# Altium schematic sheet LoraModule.SchDoc
size 420 x 297 mm; Address1: Address1; Address2: Address2; Address3: Address3; Address4: Address4; DocumentNumber: АБВГ.123456.001 Э3; SheetNumber: 1; Scale: 1:1; DocumentType: Схема электрическая принципиальная; FirstReferrence: АБВГ.123456.001
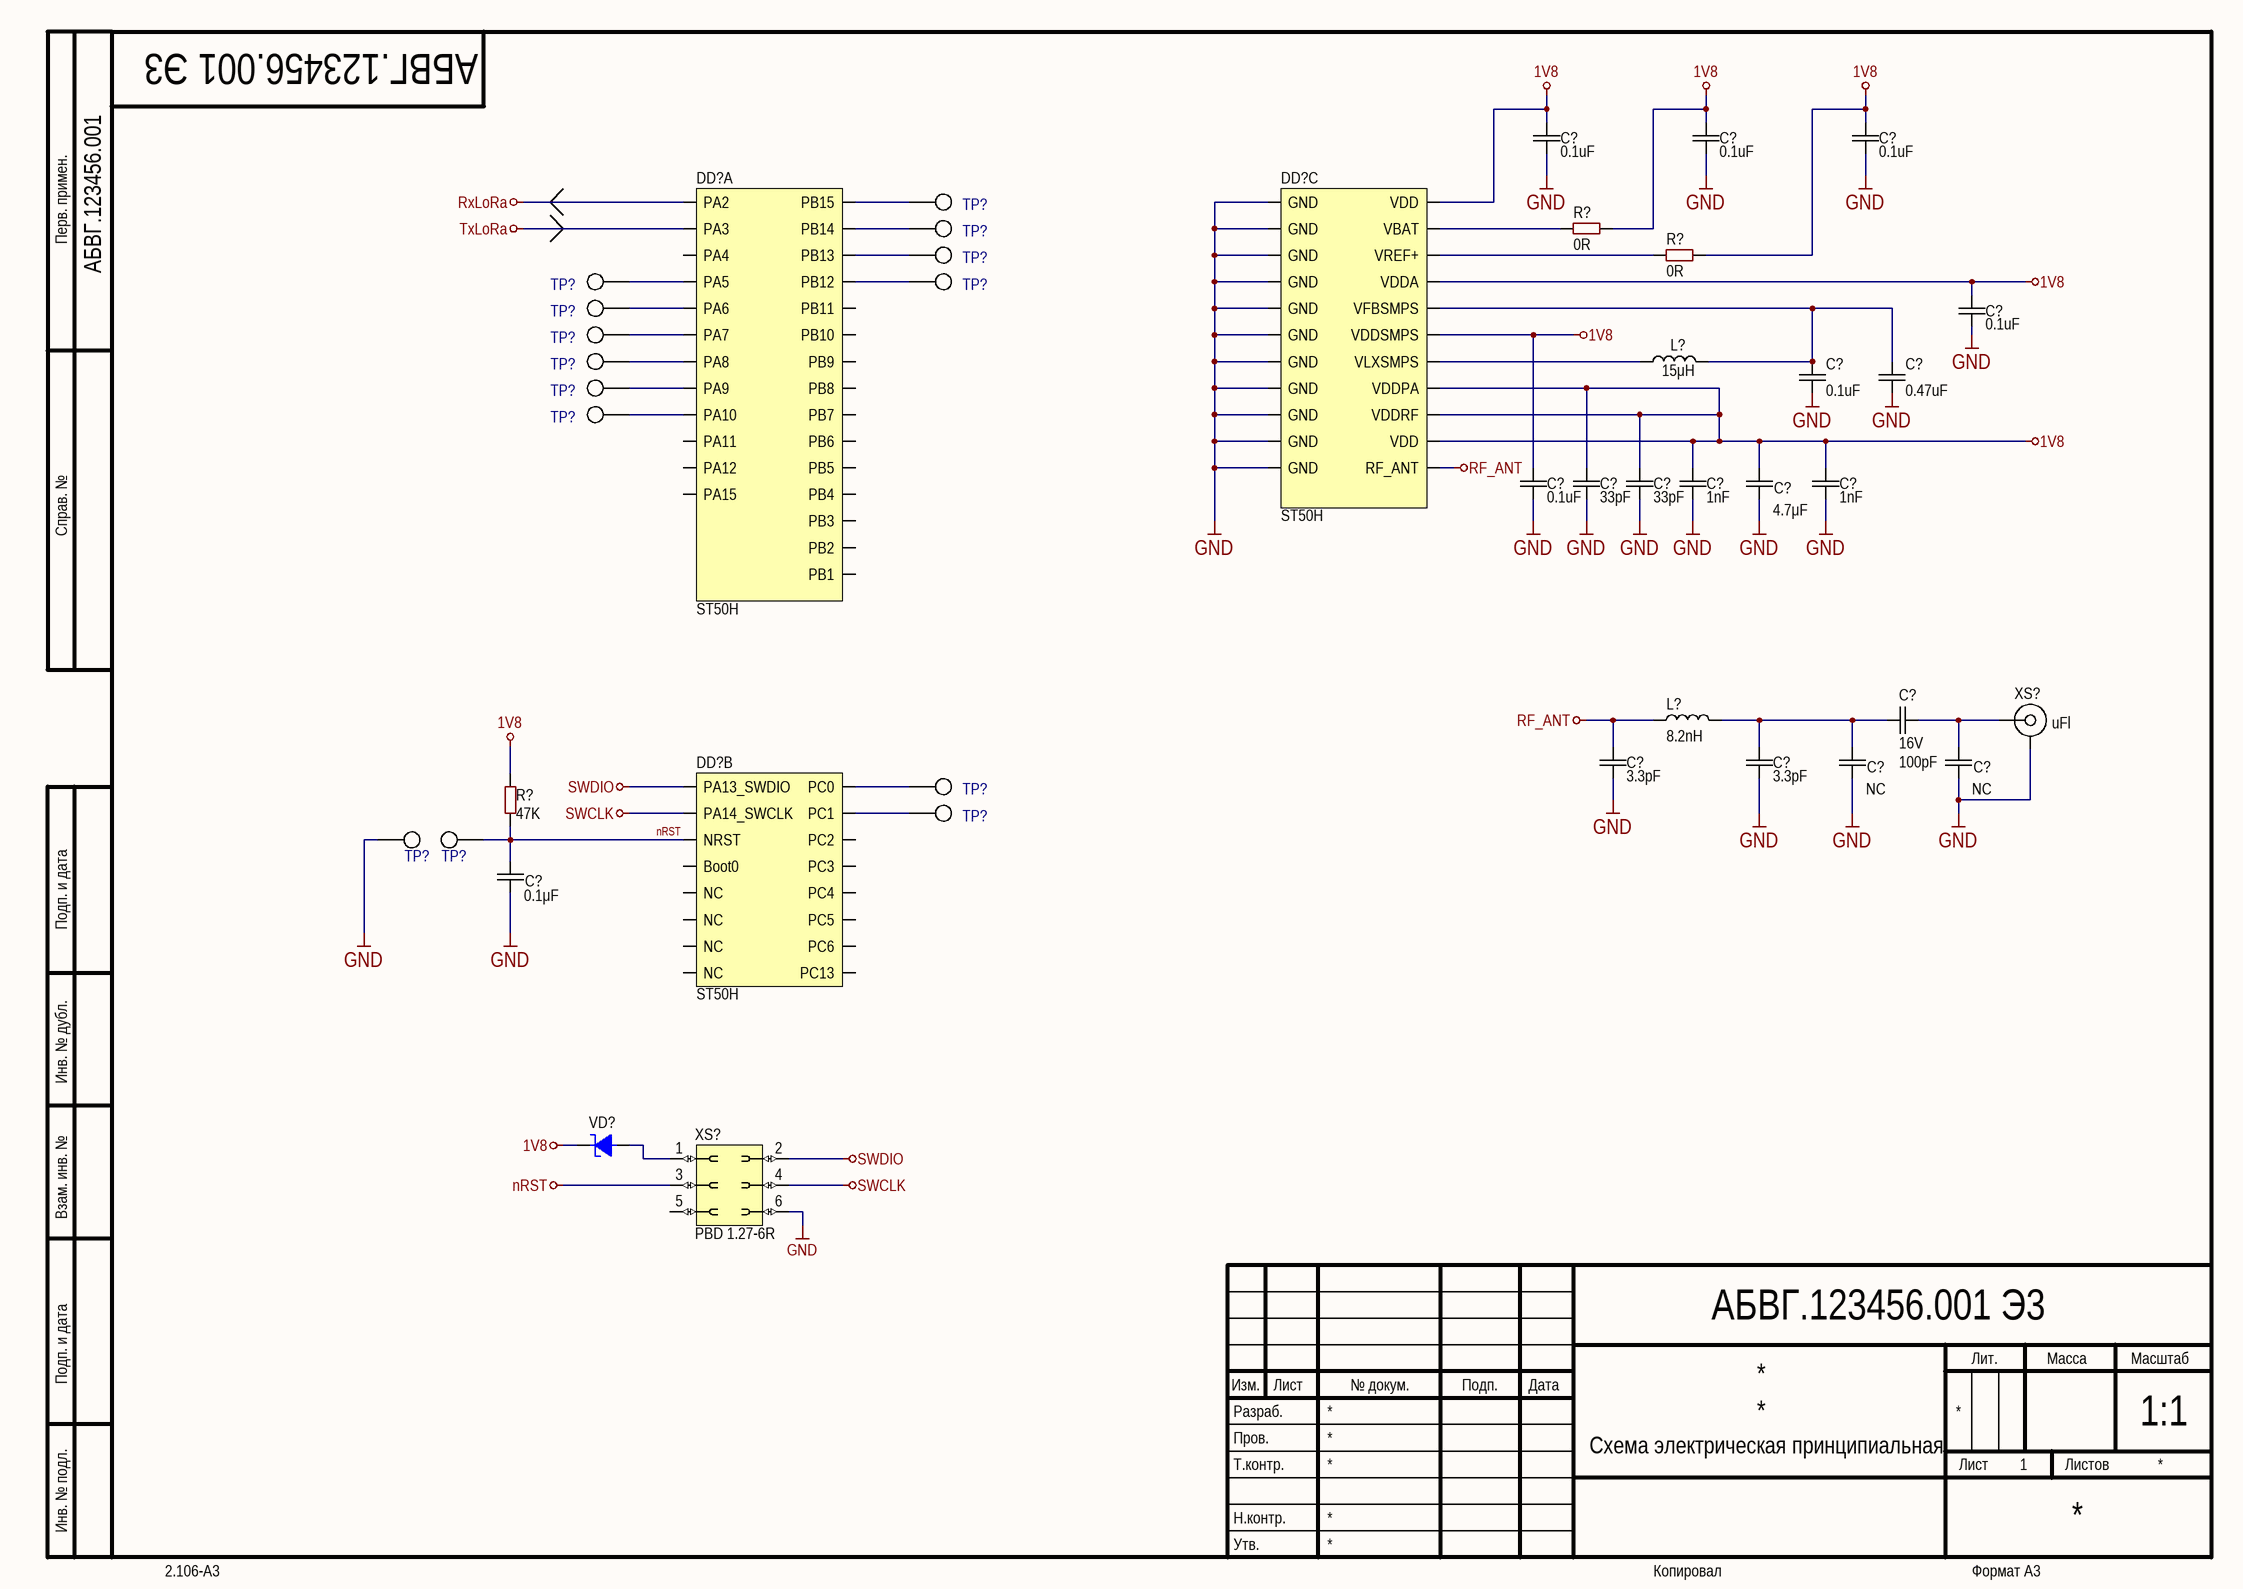
[diagram p0: LoraModule.SchDoc]

## Parts
(Parts that share a designator on the sheet are numbered #1, #2 ... from top to bottom, then left to right.)
C?#1  value 0.1uF  [CAP: 0402]
C?#2  value 0.1uF  [CAP: 0402]
C?#3  value 0.1uF  [CAP: 0402]
C?#4  value 0.1uF  [CAP: 0402]
C?#5  value 0.1uF  [CAP: 0402]
C?#6  value 0.47uF  [CAP: 0402]
C?#7  value 0.1uF  [CAP: 0402]
C?#8  value 33pF  [CAP: 0402]
C?#9  value 33pF  [CAP: 0402]
C?#10  value 1nF  [CAP: 0402]
C?#11  value 4.7μF  [CAP: 0603]
C?#12  value 1nF  [CAP: 0402]
C?#13  value 100pF  Voltage: 16V  [CAP: 0603]
C?#14  value 3.3pF  [CAP: 0402]
C?#15  value 3.3pF  [CAP: 0402]
C?#16  value NC  [CAP: 0603]
C?#17  value NC  [CAP: 0603]
C?#18  value 0.1μF  [CAP: 0402]
DD?#1  ST50H  [ST50H]  (part A of 3)
DD?#2  ST50H  [ST50H]  (part C of 3)
DD?#3  ST50H  [ST50H]  (part B of 3)
L?#1  value 15μH  [IND: 0805]
L?#2  value 8.2nH  [IND: 0402]
R?#1  value 0R  [RES: 0402]
R?#2  value 0R  [RES: 0402]
R?#3  value 47K  [RES: 0402]
TP?#1  Testpoint_HS1mm  [TestPoint(1mm_HS)]  (value not drawn)
TP?#2  Testpoint_HS1mm  [TestPoint(1mm_HS)]  (value not drawn)
TP?#3  Testpoint_HS1mm  [TestPoint(1mm_HS)]  (value not drawn)
TP?#4  Testpoint_HS1mm  [TestPoint(1mm_HS)]  (value not drawn)
TP?#5  Testpoint_HS1mm  [TestPoint(1mm_HS)]  (value not drawn)
TP?#6  Testpoint_HS1mm  [TestPoint(1mm_HS)]  (value not drawn)
TP?#7  Testpoint_HS1mm  [TestPoint(1mm_HS)]  (value not drawn)
TP?#8  Testpoint_HS1mm  [TestPoint(1mm_HS)]  (value not drawn)
TP?#9  Testpoint_HS1mm  [TestPoint(1mm_HS)]  (value not drawn)
TP?#10  Testpoint_HS1mm  [TestPoint(1mm_HS)]  (value not drawn)
TP?#11  Testpoint_HS1mm  [TestPoint(1mm_HS)]  (value not drawn)
TP?#12  Testpoint_HS1mm  [TestPoint(1mm_HS)]  (value not drawn)
TP?#13  Testpoint_HS1mm  [TestPoint(1mm_HS)]  (value not drawn)
TP?#14  Testpoint_HS1mm  [TestPoint(1mm_HS)]  (value not drawn)
VD?  (no value)  [DIODE: SOD523]
XS?#1  CommentText: uFl  [CON: u.Fl]
XS?#2  PBD 1.27-6R  [CON: PBD1.27-6]

## Nets
1V8: C?#1.2 C?#2.2 C?#3.2 C?#4.2 C?#7.2 C?#8.2 C?#9.2 C?#10.2 C?#11.2 C?#12.2 DD?#2.3(VDD) DD?#2.7(VDDA) DD?#2.11(VDDSMPS) DD?#2.53(VDDPA) DD?#2.54(VDDRF) DD?#2.55(VDD) R?#1.2 R?#2.2 R?#3.1 VD?.2
GND: C?#1.1 C?#2.1 C?#3.1 C?#4.1 C?#5.1 C?#6.2 C?#7.1 C?#8.1 C?#9.1 C?#10.1 C?#11.1 C?#12.1 C?#14.1 C?#15.1 C?#16.1 C?#17.1 C?#18.1 DD?#2.12(GND) DD?#2.28(GND) DD?#2.35(GND) DD?#2.36(GND) DD?#2.38(GND) DD?#2.39(GND) DD?#2.46(GND) DD?#2.47(GND) DD?#2.52(GND) DD?#2.56(GND) DD?#2.65(GND) TP?#13.1 XS?#1.2 XS?#2.6
nRST: C?#18.2 DD?#3.44(NRST) R?#3.2 TP?#14.1 XS?#2.3
RF_ANT: C?#14.2 DD?#2.37(RF_ANT) L?#2.1
RxLoRa: DD?#1.29(PA2)
SWCLK: DD?#3.2(PA14_SWCLK) XS?#2.4
SWDIO: DD?#3.1(PA13_SWDIO) XS?#2.2
TxLoRa: DD?#1.30(PA3)
NetC?#5_2: C?#5.2 C?#6.1 DD?#2.10(VFBSMPS) L?#1.2
NetC?#13_1: C?#13.1 C?#17.2 XS?#1.1
NetC?#13_2: C?#13.2 C?#15.2 C?#16.2 L?#2.2
NetDD?#1_9: DD?#1.9(PB15) TP?#1.1
NetDD?#1_32: DD?#1.32(PA5) TP?#4.1
NetDD?#1_33: DD?#1.33(PA6) TP?#6.1
NetDD?#1_34: DD?#1.34(PA7) TP?#7.1
NetDD?#1_50: DD?#1.50(PA9) TP?#9.1
NetDD?#1_51: DD?#1.51(PA8) TP?#8.1
NetDD?#1_59: DD?#1.59(PB12) TP?#5.1
NetDD?#1_60: DD?#1.60(PB13) TP?#3.1
NetDD?#1_61: DD?#1.61(PB14) TP?#2.1
NetDD?#1_62: DD?#1.62(PA10) TP?#10.1
NetDD?#2_4: DD?#2.4(VBAT) R?#1.1
NetDD?#2_6: DD?#2.6(VREF+) R?#2.1
NetDD?#2_13: DD?#2.13(VLXSMPS) L?#1.1
NetDD?#3_21: DD?#3.21(PC0) TP?#11.1
NetDD?#3_22: DD?#3.22(PC1) TP?#12.1
NetVD?_1: VD?.1 XS?#2.1

Not connected (* = marked no-connect by the designer): DD?#1 8(PA15) 14(PB3) 15(PB4) 16(PB5) 17(PB6) 18(PB7) 19(PB8) 20(PB9) 31(PA4) 48(PB11) 49(PB10) 57(PB1) 58(PB2) 63(PA11) 64(PA12); DD?#3 5(PC13) 23(PC2) 24(PC3) 25(PC4) 26(PC5) 27(PC6) 40(NC) 41(NC) 42(NC) 43(Boot0) 45(NC); XS?#2 5

## Notes on the sheet
- Перв. примен.
- Справ. №
- Подп. и дата
- Инв. № дубл.
- Взам. инв. №
- Разраб.
- Изм.
- Лист
- № докум.
- Подп.
- Дата
- Лит.
- Масса
- Масштаб
- Пров.
- Т.контр.
- Листов
- Инв. № подл.
- Утв.
- Н.контр.
- 2.106-A3
- Копировал
- Формат А3

## Library data of the parts
C?#1-C?#5 C?#7 = Ceramic_0402: Manufacturer: Yageo; PartNumber: CC0402KRX7R7BB104; ValueManufacturerPartNumber: Ceramic capacitor, 0.1uF, X7R, ±10%, 16V, 0402, -55...+125°C; TypeCapacitor: Ceramic capacitor; Tolerance: ±10%; TypeDielectric: X7R; Voltage: 16V; Package: 0402; HelpURL: https://www.digikey.com/product-detail/en/yageo/CC0402KRX7R7BB104/311-1338-1-ND/2103122; Temperature: -55...+125°C
C?#6 = Ceramic_0402: Manufacturer: Yageo; PartNumber: CC0402KRX7R7BB104; ValueManufacturerPartNumber: Ceramic capacitor, 0.47uF, X7R, ±10%, 16V, 0402, -55...+125°C; TypeCapacitor: Ceramic capacitor; Tolerance: ±10%; TypeDielectric: X7R; Voltage: 16V; Package: 0402; HelpURL: https://www.digikey.com/product-detail/en/yageo/CC0402KRX7R7BB104/311-1338-1-ND/2103122; Temperature: -55...+125°C
C?#8 C?#9 = Ceramic_0402: Manufacturer: Yageo; PartNumber: CC0402KRX7R7BB104; ValueManufacturerPartNumber: Ceramic capacitor, 33pF, X7R, ±10%, 16V, 0402, -55...+125°C; TypeCapacitor: Ceramic capacitor; Tolerance: ±10%; TypeDielectric: X7R; Voltage: 16V; Package: 0402; HelpURL: https://www.digikey.com/product-detail/en/yageo/CC0402KRX7R7BB104/311-1338-1-ND/2103122; Temperature: -55...+125°C
C?#10 C?#12 = Ceramic_0402: Manufacturer: Yageo; PartNumber: CC0402KRX7R7BB104; ValueManufacturerPartNumber: Ceramic capacitor, 1nF, X7R, ±10%, 16V, 0402, -55...+125°C; TypeCapacitor: Ceramic capacitor; Tolerance: ±10%; TypeDielectric: X7R; Voltage: 16V; Package: 0402; HelpURL: https://www.digikey.com/product-detail/en/yageo/CC0402KRX7R7BB104/311-1338-1-ND/2103122; Temperature: -55...+125°C
C?#11 = Ceramic_0603: Manufacturer: Yageo; PartNumber: CC0603KRX7R7BB104; ValueManufacturerPartNumber: Ceramic capacitor, 4.7μF, X7R, ±10%, 16V, 0603, -55...+125°C; TypeCapacitor: Ceramic capacitor; Tolerance: ±10%; TypeDielectric: X7R; Voltage: 16V; Package: 0603; HelpURL: https://www.digikey.com/product-detail/en/yageo/CC0603KRX7R7BB104/311-1088-1-ND/302998; Temperature: -55...+125°C
C?#13 = Ceramic_0603: Manufacturer: Yageo; PartNumber: CC0603KRX7R7BB104; ValueManufacturerPartNumber: Ceramic capacitor, 100pF, X7R, ±10%, 16V, 0603, -55...+125°C; TypeCapacitor: Ceramic capacitor; Tolerance: ±10%; TypeDielectric: X7R; Package: 0603; HelpURL: https://www.digikey.com/product-detail/en/yageo/CC0603KRX7R7BB104/311-1088-1-ND/302998; Temperature: -55...+125°C
C?#14 C?#15 = Ceramic_0402: Manufacturer: Yageo; PartNumber: CC0402KRX7R7BB104; ValueManufacturerPartNumber: Ceramic capacitor, 3.3pF, X7R, ±10%, 16V, 0402, -55...+125°C; TypeCapacitor: Ceramic capacitor; Tolerance: ±10%; TypeDielectric: X7R; Voltage: 16V; Package: 0402; HelpURL: https://www.digikey.com/product-detail/en/yageo/CC0402KRX7R7BB104/311-1338-1-ND/2103122; Temperature: -55...+125°C
C?#16 C?#17 = Ceramic_0603: Manufacturer: Yageo; PartNumber: CC0603KRX7R7BB104; ValueManufacturerPartNumber: Ceramic capacitor, NC, X7R, ±10%, 16V, 0603, -55...+125°C; TypeCapacitor: Ceramic capacitor; Tolerance: ±10%; TypeDielectric: X7R; Voltage: 16V; Package: 0603; HelpURL: https://www.digikey.com/product-detail/en/yageo/CC0603KRX7R7BB104/311-1088-1-ND/302998; Temperature: -55...+125°C
C?#18 = Ceramic_0402: Manufacturer: Yageo; PartNumber: CC0402KRX7R7BB104; ValueManufacturerPartNumber: Ceramic capacitor, 0.1μF, X7R, ±10%, 16V, 0402, -55...+125°C; TypeCapacitor: Ceramic capacitor; Tolerance: ±10%; TypeDielectric: X7R; Voltage: 16V; Package: 0402; HelpURL: https://www.digikey.com/product-detail/en/yageo/CC0402KRX7R7BB104/311-1338-1-ND/2103122; Temperature: -55...+125°C
DD?#1-DD?#3 = ST50H: LoRa module
L?#1 = Inductor_0805: Manufacturer: Murata Electronics; PartNumber: LQM21FN100M70L; ValueManufacturerPartNumber: Fixed inductor, 15μH, ±20%, 0805, 100mA, -55...+125°C; TypeInductor: Fixed inductor; MaxCurrent: 100mA; Tolerance: ±20%; Package: 0805; HelpURL: https://www.digikey.com/product-detail/en/murata-electronics-north-america/LQM21FN100M70L/490-4029-1-ND/1016289; Temperature: -55...+125°C
L?#2 = Inductor_0402: Manufacturer: Murata Electronics; PartNumber: LQG15HSR10J02D; ValueManufacturerPartNumber: Fixed inductor, 8.2nH, ±5%, 0402, 200mA, -55...+125°C; TypeInductor: Fixed inductor; MaxCurrent: 200mA; Tolerance: ±5%; Package: 0402; HelpURL: https://www.digikey.com/product-detail/en/murata-electronics-north-america/LQG15HSR10J02D/490-2635-1-ND/662915; Temperature: -55...+125°C
R?#1 R?#2 = Resistor_0402: Manufacturer: Yageo; PartNumber: RC0402JR-07100RL; ValueManufacturerPartNumber: Resistor film, 0R, ±5%, 0402, 0.063W, -55...+125°C; TypeResistor: Resistor film; Power: 0.063W; Tolerance: ±5%; Package: 0402; HelpURL: https://www.digikey.com/product-detail/en/yageo/RC0402JR-07100RL/311-100JRCT-ND/729362; Temperature: -55...+125°C
R?#3 = Resistor_0402: Manufacturer: Yageo; PartNumber: RC0402JR-07100RL; ValueManufacturerPartNumber: Resistor film, 47K, ±5%, 0402, 0.063W, -55...+125°C; TypeResistor: Resistor film; Power: 0.063W; Tolerance: ±5%; Package: 0402; HelpURL: https://www.digikey.com/product-detail/en/yageo/RC0402JR-07100RL/311-100JRCT-ND/729362; Temperature: -55...+125°C
VD? = Schottky_single: Manufacturer: Diodes Incorporated; ValueManufacturerPartNumber: Schottky diode, 80V, 500mA, 1V, 15pF, SOD-123, -55...+150°C; PartNumber: BAT54XV2; TypeDiode: Schottky diode; Voltage: 80V; Current: 500mA; VoltageDrop: 1V; RecoveryTime: 15pF; Package: SOD-123; HelpURL: https://www.digikey.com/product-detail/en/diodes-incorporated/MBR0580S1-7/MBR0580S1-7DICT-ND/5080371; Temperature: -55...+150°C
XS?#1 = Connector_uFL: Manufacturer: Hirose Electric; ValueManufacturerPartNumber: Connector u.FL, 50 Ohm, 6GHz; PartNumber: U.FL-R-SMT(01); TypeConnector: Connector u.FL; Frequency: 6GHz; Impedance: 50 Ohm; HelpURL: https://www.digikey.com/product-detail/en/hirose-electric-co-ltd/U.FL-R-SMT-01/H9161-ND/513010